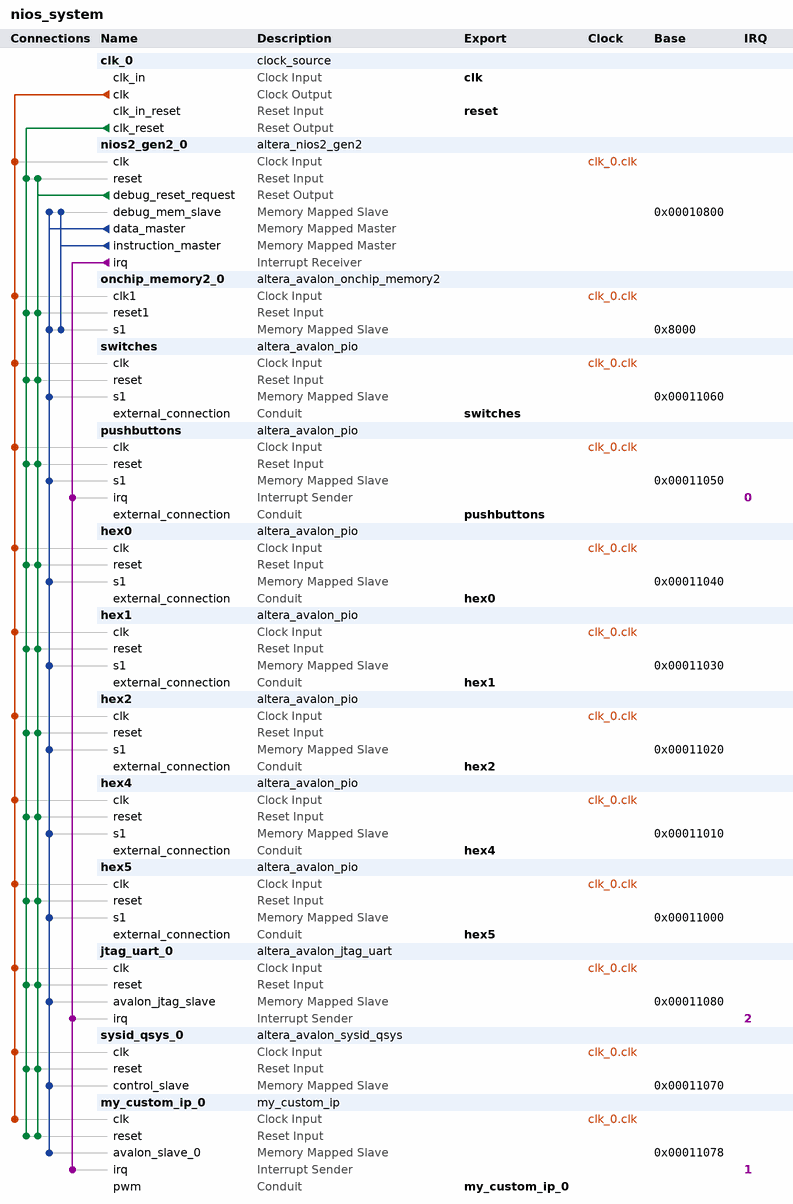
[diagram p0: system contents]
# Platform Designer (Qsys) system nios_system, Cyclone V 5CSEMA5F31C6
# Parameters at their usual value, and those the tool derives, are not listed.
package require -exact qsys 18.1
create_system nios_system
set_project_property DEVICE_FAMILY {Cyclone V}
set_project_property DEVICE 5CSEMA5F31C6

add_instance clk_0 clock_source 18.1
set_instance_parameter_value clk_0 clockFrequency 50000000

add_instance nios2_gen2_0 altera_nios2_gen2 18.1
set_instance_parameter_value nios2_gen2_0 dcache_size 2048
set_instance_parameter_value nios2_gen2_0 exceptionSlave onchip_memory2_0.s1
set_instance_parameter_value nios2_gen2_0 icache_size 4096
set_instance_parameter_value nios2_gen2_0 impl Tiny
set_instance_parameter_value nios2_gen2_0 resetSlave onchip_memory2_0.s1

add_instance onchip_memory2_0 altera_avalon_onchip_memory2 18.1
set_instance_parameter_value onchip_memory2_0 dataWidth 32
set_instance_parameter_value onchip_memory2_0 dualPort false
set_instance_parameter_value onchip_memory2_0 initMemContent true
set_instance_parameter_value onchip_memory2_0 initializationFileName onchip_mem.hex
set_instance_parameter_value onchip_memory2_0 memorySize 32768

add_instance switches altera_avalon_pio 18.1
set_instance_parameter_value switches direction Input
set_instance_parameter_value switches width 8

add_instance pushbuttons altera_avalon_pio 18.1
set_instance_parameter_value pushbuttons captureEdge true
set_instance_parameter_value pushbuttons direction Input
set_instance_parameter_value pushbuttons edgeType FALLING
set_instance_parameter_value pushbuttons generateIRQ true
set_instance_parameter_value pushbuttons irqType EDGE
set_instance_parameter_value pushbuttons width 4

add_instance hex0 altera_avalon_pio 18.1
set_instance_parameter_value hex0 direction Output
set_instance_parameter_value hex0 width 7

add_instance hex1 altera_avalon_pio 18.1
set_instance_parameter_value hex1 direction Output
set_instance_parameter_value hex1 width 7

add_instance hex2 altera_avalon_pio 18.1
set_instance_parameter_value hex2 direction Output
set_instance_parameter_value hex2 width 7

add_instance hex4 altera_avalon_pio 18.1
set_instance_parameter_value hex4 direction Output
set_instance_parameter_value hex4 width 7

add_instance hex5 altera_avalon_pio 18.1
set_instance_parameter_value hex5 direction Output
set_instance_parameter_value hex5 width 7

add_instance jtag_uart_0 altera_avalon_jtag_uart 18.1
set_instance_parameter_value jtag_uart_0 simInteractiveOptions NO_INTERACTIVE_WINDOWS

add_instance sysid_qsys_0 altera_avalon_sysid_qsys 18.1
set_instance_parameter_value sysid_qsys_0 id 12

add_instance my_custom_ip_0 my_custom_ip 1.0

# connections
add_connection clk_0.clk hex0.clk clock
add_connection clk_0.clk hex1.clk clock
add_connection clk_0.clk hex2.clk clock
add_connection clk_0.clk hex4.clk clock
add_connection clk_0.clk hex5.clk clock
add_connection clk_0.clk jtag_uart_0.clk clock
add_connection clk_0.clk my_custom_ip_0.clk clock
add_connection clk_0.clk nios2_gen2_0.clk clock
add_connection clk_0.clk onchip_memory2_0.clk1 clock
add_connection clk_0.clk pushbuttons.clk clock
add_connection clk_0.clk switches.clk clock
add_connection clk_0.clk sysid_qsys_0.clk clock
add_connection clk_0.clk_reset hex0.reset reset
add_connection clk_0.clk_reset hex1.reset reset
add_connection clk_0.clk_reset hex2.reset reset
add_connection clk_0.clk_reset hex4.reset reset
add_connection clk_0.clk_reset hex5.reset reset
add_connection clk_0.clk_reset jtag_uart_0.reset reset
add_connection clk_0.clk_reset my_custom_ip_0.reset reset
add_connection clk_0.clk_reset nios2_gen2_0.reset reset
add_connection clk_0.clk_reset onchip_memory2_0.reset1 reset
add_connection clk_0.clk_reset pushbuttons.reset reset
add_connection clk_0.clk_reset switches.reset reset
add_connection clk_0.clk_reset sysid_qsys_0.reset reset
add_connection nios2_gen2_0.debug_reset_request hex0.reset reset
add_connection nios2_gen2_0.debug_reset_request hex1.reset reset
add_connection nios2_gen2_0.debug_reset_request hex2.reset reset
add_connection nios2_gen2_0.debug_reset_request hex4.reset reset
add_connection nios2_gen2_0.debug_reset_request hex5.reset reset
add_connection nios2_gen2_0.debug_reset_request jtag_uart_0.reset reset
add_connection nios2_gen2_0.debug_reset_request my_custom_ip_0.reset reset
add_connection nios2_gen2_0.debug_reset_request nios2_gen2_0.reset reset
add_connection nios2_gen2_0.debug_reset_request onchip_memory2_0.reset1 reset
add_connection nios2_gen2_0.debug_reset_request pushbuttons.reset reset
add_connection nios2_gen2_0.debug_reset_request switches.reset reset
add_connection nios2_gen2_0.debug_reset_request sysid_qsys_0.reset reset
add_connection nios2_gen2_0.data_master hex0.s1 avalon
set_connection_parameter_value nios2_gen2_0.data_master/hex0.s1 baseAddress 0x00011040
add_connection nios2_gen2_0.data_master hex1.s1 avalon
set_connection_parameter_value nios2_gen2_0.data_master/hex1.s1 baseAddress 0x00011030
add_connection nios2_gen2_0.data_master hex2.s1 avalon
set_connection_parameter_value nios2_gen2_0.data_master/hex2.s1 baseAddress 0x00011020
add_connection nios2_gen2_0.data_master hex4.s1 avalon
set_connection_parameter_value nios2_gen2_0.data_master/hex4.s1 baseAddress 0x00011010
add_connection nios2_gen2_0.data_master hex5.s1 avalon
set_connection_parameter_value nios2_gen2_0.data_master/hex5.s1 baseAddress 0x00011000
add_connection nios2_gen2_0.data_master jtag_uart_0.avalon_jtag_slave avalon
set_connection_parameter_value nios2_gen2_0.data_master/jtag_uart_0.avalon_jtag_slave baseAddress 0x00011080
add_connection nios2_gen2_0.data_master my_custom_ip_0.avalon_slave_0 avalon
set_connection_parameter_value nios2_gen2_0.data_master/my_custom_ip_0.avalon_slave_0 baseAddress 0x00011078
add_connection nios2_gen2_0.data_master nios2_gen2_0.debug_mem_slave avalon
set_connection_parameter_value nios2_gen2_0.data_master/nios2_gen2_0.debug_mem_slave baseAddress 0x00010800
add_connection nios2_gen2_0.data_master onchip_memory2_0.s1 avalon
set_connection_parameter_value nios2_gen2_0.data_master/onchip_memory2_0.s1 baseAddress 0x8000
add_connection nios2_gen2_0.data_master pushbuttons.s1 avalon
set_connection_parameter_value nios2_gen2_0.data_master/pushbuttons.s1 baseAddress 0x00011050
add_connection nios2_gen2_0.data_master switches.s1 avalon
set_connection_parameter_value nios2_gen2_0.data_master/switches.s1 baseAddress 0x00011060
add_connection nios2_gen2_0.data_master sysid_qsys_0.control_slave avalon
set_connection_parameter_value nios2_gen2_0.data_master/sysid_qsys_0.control_slave baseAddress 0x00011070
add_connection nios2_gen2_0.instruction_master nios2_gen2_0.debug_mem_slave avalon
set_connection_parameter_value nios2_gen2_0.instruction_master/nios2_gen2_0.debug_mem_slave baseAddress 0x00010800
add_connection nios2_gen2_0.instruction_master onchip_memory2_0.s1 avalon
set_connection_parameter_value nios2_gen2_0.instruction_master/onchip_memory2_0.s1 baseAddress 0x8000
add_connection nios2_gen2_0.irq jtag_uart_0.irq interrupt
set_connection_parameter_value nios2_gen2_0.irq/jtag_uart_0.irq irqNumber 2
add_connection nios2_gen2_0.irq my_custom_ip_0.irq interrupt
set_connection_parameter_value nios2_gen2_0.irq/my_custom_ip_0.irq irqNumber 1
add_connection nios2_gen2_0.irq pushbuttons.irq interrupt
set_connection_parameter_value nios2_gen2_0.irq/pushbuttons.irq irqNumber 0

# exported interfaces
add_interface clk clock sink
set_interface_property clk EXPORT_OF clk_0.clk_in
add_interface hex0 conduit end
set_interface_property hex0 EXPORT_OF hex0.external_connection
add_interface hex1 conduit end
set_interface_property hex1 EXPORT_OF hex1.external_connection
add_interface hex2 conduit end
set_interface_property hex2 EXPORT_OF hex2.external_connection
add_interface hex4 conduit end
set_interface_property hex4 EXPORT_OF hex4.external_connection
add_interface hex5 conduit end
set_interface_property hex5 EXPORT_OF hex5.external_connection
add_interface my_custom_ip_0 conduit end
set_interface_property my_custom_ip_0 EXPORT_OF my_custom_ip_0.pwm
add_interface pushbuttons conduit end
set_interface_property pushbuttons EXPORT_OF pushbuttons.external_connection
add_interface reset reset sink
set_interface_property reset EXPORT_OF clk_0.clk_in_reset
add_interface switches conduit end
set_interface_property switches EXPORT_OF switches.external_connection

set_interconnect_requirement {$system} qsys_mm.clockCrossingAdapter HANDSHAKE
set_interconnect_requirement {$system} qsys_mm.enableEccProtection FALSE
set_interconnect_requirement {$system} qsys_mm.insertDefaultSlave FALSE
set_interconnect_requirement {$system} qsys_mm.maxAdditionalLatency 1

save_system nios_system.qsys
